# Altium schematic sheet Main.SchDoc
size A4
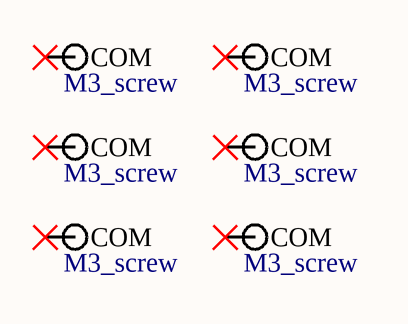
[diagram p0: Main.SchDoc]

## Parts
TH1  M3_screw  [m3_w_tol_1p9]
TH2  M3_screw  [m3_w_tol_1p9]
TH3  M3_screw  [m3_w_tol_1p9]
TH4  M3_screw  [m3_w_tol_1p9]
TH5  M3_screw  [m3_w_tol_1p9]
TH6  M3_screw  [m3_w_tol_1p9]

## Nets

Not connected (* = marked no-connect by the designer): TH1 0(COM)*; TH2 0(COM)*; TH3 0(COM)*; TH4 0(COM)*; TH5 0(COM)*; TH6 0(COM)*